# Altium schematic sheet Top Level.SchDoc
size A4
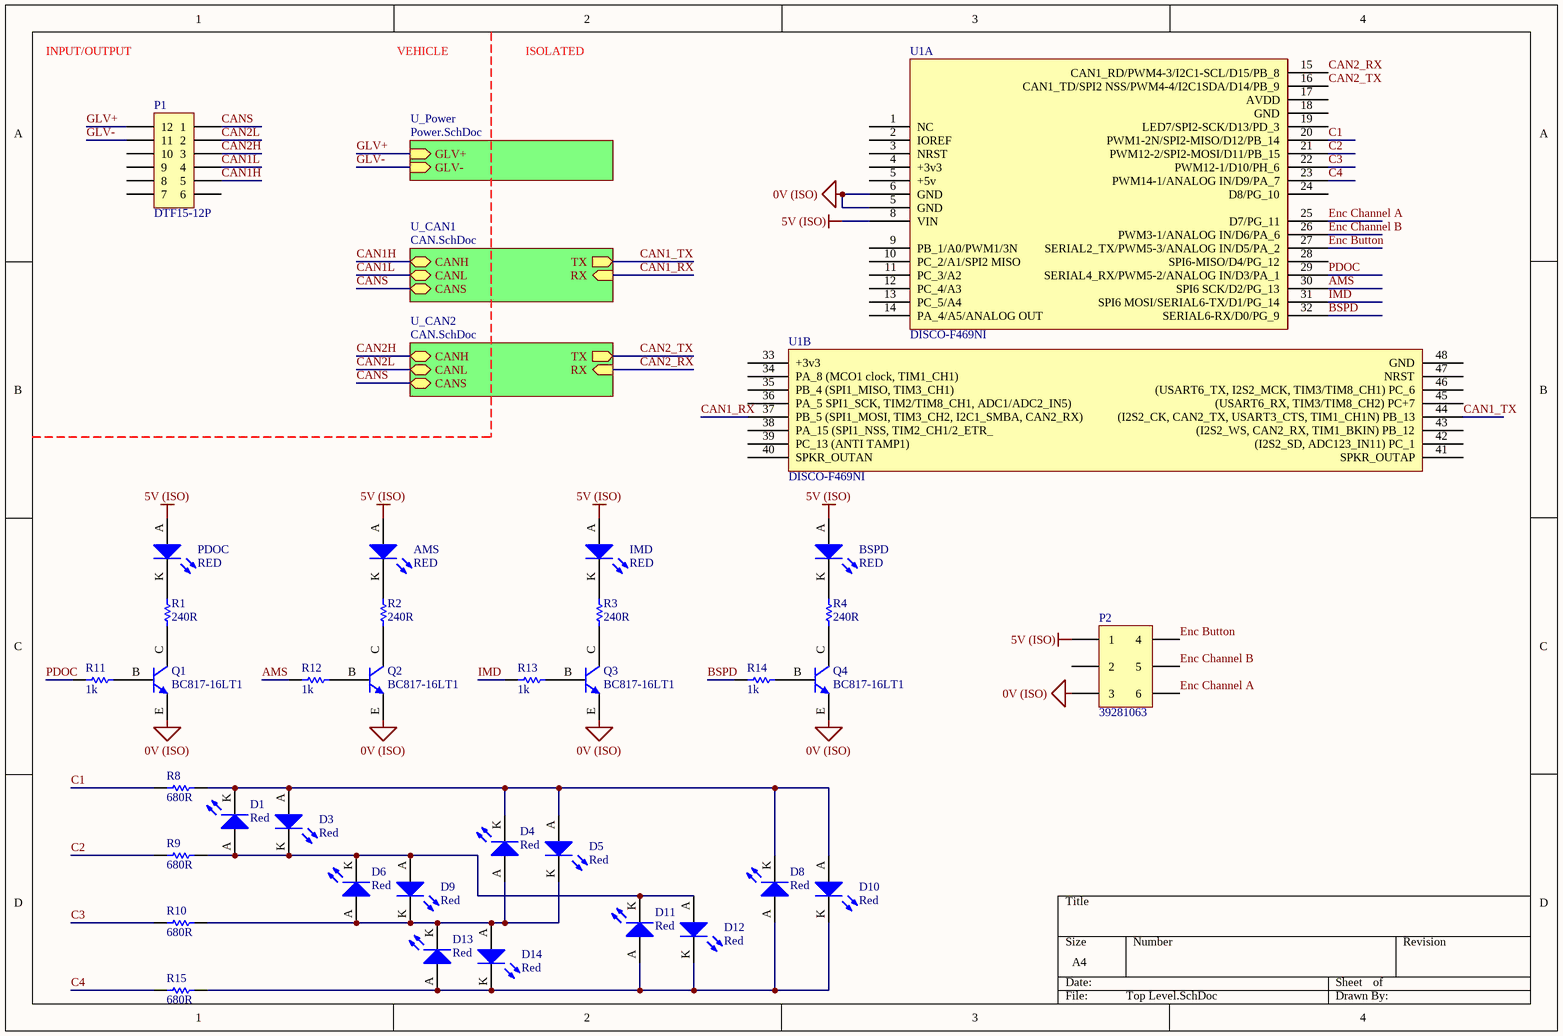
[diagram p0: Top Level.SchDoc]

## Parts
AMS  RED  [5MM LED]
BSPD  RED  [5MM LED]
D1  Red  [0805 LED]
D3  Red  [0805 LED]
D4  Red  [0805 LED]
D5  Red  [0805 LED]
D6  Red  [0805 LED]
D8  Red  [0805 LED]
D9  Red  [0805 LED]
D10  Red  [0805 LED]
D11  Red  [0805 LED]
D12  Red  [0805 LED]
D13  Red  [0805 LED]
D14  Red  [0805 LED]
IMD  RED  [5MM LED]
P1  DTF15-12P  [DTF15-12P]
P2  39281063  [39281063]
PDOC  RED  [5MM LED]
Q1  BC817-16LT1  [ON SOT-23 BJT]
Q2  BC817-16LT1  [ON SOT-23 BJT]
Q3  BC817-16LT1  [ON SOT-23 BJT]
Q4  BC817-16LT1  [ON SOT-23 BJT]
R1  240R  [0805]
R2  240R  [0805]
R3  240R  [0805]
R4  240R  [0805]
R8  680R  [0805]
R9  680R  [0805]
R10  680R  [0805]
R11  1k  [0805]
R12  1k  [0805]
R13  1k  [0805]
R14  1k  [0805]
R15  680R  [0805]
U1  DISCO-F469NI  [DISCO-F469NI]  (parts A,B of 2)

## Sub-sheets
U_CAN1 = CAN.SchDoc: CANH (bidir), CANL (bidir), CANS (bidir), RX (in), TX (out)
U_CAN2 = CAN.SchDoc: CANH (bidir), CANL (bidir), CANS (bidir), RX (in), TX (out)
U_Power = Power.SchDoc: GLV+ (in), GLV- (in)

## Nets
0V (ISO): P2.3 Q1.E Q2.E Q3.E Q4.E U1.5(GND) U1.6(GND)
5V (ISO): AMS.A BSPD.A IMD.A P2.1 PDOC.A U1.8(VIN)
AMS: R12.1 U1.30(SPI6_SCK/D2/PG_13)
BSPD: R14.1 U1.32(SERIAL6-RX/D0/PG_9)
C1: R8.2 U1.20(PWM1-2N/SPI2-MISO/D12/PB_14)
C2: R9.2 U1.21(PWM12-2/SPI2-MOSI/D11/PB_15)
C3: R10.2 U1.22(PWM12-1/D10/PH_6)
C4: R15.2 U1.23(PWM14-1/ANALOG_IN/D9/PA_7)
CAN1_RX: U1.37(PB_5_(SPI1_MOSI,_TIM3_CH2,_I2C1_SMBA,_CAN2_RX)) ; sheet U_CAN1/RX
CAN1_TX: U1.44((I2S2_CK,_CAN2_TX,_USART3_CTS,_TIM1_CH1N)_PB_13) ; sheet U_CAN1/TX
CAN1H: P1.5 ; sheet U_CAN1/CANH
CAN1L: P1.4 ; sheet U_CAN1/CANL
CAN2_RX: U1.15(CAN1_RD/PWM4-3/I2C1-SCL/D15/PB_8) ; sheet U_CAN2/RX
CAN2_TX: U1.16(CAN1_TD/SPI2_NSS/PWM4-4/I2C1SDA/D14/PB_9) ; sheet U_CAN2/TX
CAN2H: P1.3 ; sheet U_CAN2/CANH
CAN2L: P1.2 ; sheet U_CAN2/CANL
CANS: P1.1 ; sheet U_CAN2/CANS, sheet U_CAN1/CANS
Enc Button: P2.4 U1.27(SERIAL2_TX/PWM5-3/ANALOG_IN/D5/PA_2)
Enc Channel A: P2.6 U1.25(D7/PG_11)
Enc Channel B: P2.5 U1.26(PWM3-1/ANALOG_IN/D6/PA_6)
GLV+: P1.12 ; sheet U_Power/GLV+
GLV-: P1.11 ; sheet U_Power/GLV-
IMD: R13.1 U1.31(SPI6_MOSI/SERIAL6-TX/D1/PG_14)
PDOC: R11.1 U1.29(SERIAL4_RX/PWM5-2/ANALOG_IN/D3/PA_1)
NetAMS_K: AMS.K R2.2
NetBSPD_K: BSPD.K R4.2
NetD1_A: D1.A D3.K D6.K D9.A D11.K D12.A R9.1
NetD1_K: D1.K D3.A D4.K D5.A D8.K D10.A R8.1
NetD4_A: D4.A D5.K D6.A D9.K D13.K D14.A R10.1
NetD8_A: D8.A D10.K D11.A D12.K D13.A D14.K R15.1
NetIMD_K: IMD.K R3.2
NetPDOC_K: PDOC.K R1.2
NetQ1_B: Q1.B R11.2
NetQ1_C: Q1.C R1.1
NetQ2_B: Q2.B R12.2
NetQ2_C: Q2.C R2.1
NetQ3_B: Q3.B R13.2
NetQ3_C: Q3.C R3.1
NetQ4_B: Q4.B R14.2
NetQ4_C: Q4.C R4.1

Not connected (* = marked no-connect by the designer): P1 6 7 8 9 10; P2 2; U1 1(NC) 2(IOREF) 3(NRST) 4(+3v3) 9(PB_1/A0/PWM1/3N) 10(PC_2/A1/SPI2_MISO) 11(PC_3/A2) 12(PC_4/A3) 13(PC_5/A4) 14(PA_4/A5/ANALOG_OUT) 17(AVDD) 18(GND) 19(LED7/SPI2-SCK/D13/PD_3) 24(D8/PG_10) 28(SPI6-MISO/D4/PG_12) 33(+3v3) 34(PA_8_(MCO1_clock,_TIM1_CH1)) 35(PB_4_(SPI1_MISO,_TIM3_CH1)) 36(PA_5_SPI1_SCK,_TIM2/TIM8_CH1,_ADC1/ADC2_IN5)) 38(PA_15_(SPI1_NSS,_TIM2_CH1/2_ETR_) 39(PC_13_(ANTI_TAMP1)) 40(SPKR_OUTAN) 41(SPKR_OUTAP) 42((I2S2_SD,_ADC123_IN11)_PC_1) 43((I2S2_WS,_CAN2_RX,_TIM1_BKIN)_PB_12) 45((USART6_RX,_TIM3/TIM8_CH2)_PC+7) 46((USART6_TX,_I2S2_MCK,_TIM3/TIM8_CH1)_PC_6) 47(NRST) 48(GND)

## Notes on the sheet
- INPUT/OUTPUT
- VEHICLE
- ISOLATED

## Library data of the parts
AMS BSPD IMD PDOC = C503B-GAN-CB0F0791: LED RED CLEAR 5MM ROUND T/H; Manufacturer: Cree Inc.; Part Number: C503B-GAN-CB0F0791; Colour: Green; Digikey Part Number: C503B-GAN-CB0F0791-ND; Digikey Link: https://www.digikey.com/products/en?mpart=C503B-GAN-CB0F0791&v=90&fbclid=IwAR2JUDlssEKQKztQKB3h34IlXIXn-Voov26K1DpWHwQ6mgzekaFZMifRLJU
D1 D3-D6 D8-D14 = SML-210LTT86: Red LED Indication - Discrete 1.75V 0805 (2012 Metric); Manufacturer: ROHM Semiconductor; Part Number: SML-210LTT86; Colour: Red; Digikey Part Number: 511-1286-1-ND; Digikey Link: https://www.digikey.com/product-detail/en/rohm-semiconductor/SML-210LTT86/511-1286-1-ND/637099
P1 = DT15-12P: Positions: 12; Pitch: 4.44mm; Row Spacing: 9.12 mm; Angle: 0; Flange: No; Contact: Copper Alloy; Part Number: DTF15-12P; Digikey Part Number: 1734-1647-ND; Digikey Link: https://www.digikey.com.au/product-detail/en/te-connectivity-deutsch-connectors/DTF15-12PA/1734-1647-ND/7220164
P2 = 39281063: Mini-Fit VERT 3x2; Positions: 6; Pitch: 4.20mm; Row Spacing: 4.2mm; Angle: 0; Flange: No; Contact: Gold; Part Number: 39281063; Digikey Part Number: WM3802-ND; Digikey Link: https://www.digikey.com/product-detail/en/molex/0039281063/WM3802-ND/61404
Q1-Q4 = BC817-16LT1: 300mW  BJT NPN Transistor; Manufacturer: ON Semiconductor; Part Number: BC817-16LT1; Digikey Part Number: BC817-16LT1OSTR-ND; Digikey Link: https://www.digikey.com.au/product-detail/en/on-semiconductor/BC817-16LT1/BC817-16LT1OSTR-ND/606178
R1-R4 = RC0805FR07240RL: Manufacturer: YAGEO; Tolerance: 0.01; Rated Voltage: 0.125W; Part Number: RC0805FR07240RL; Value: 240R; Material: FR-07; qty: 50
R8-R10 R15 = RC0805FR07680RL: Manufacturer: YAGEO; Tolerance: 0.01; Rated Voltage: 0.125W; Part Number: RC0805FR07680RL; Value: 680R; Material: FR-07; qty: 50
R11-R14 = RC0805FR071KL: Manufacturer: YAGEO; Tolerance: 0.01; Rated Voltage: 0.125W; Part Number: RC0805FR071KL; Value: 1k; Material: FR-07; qty: 50
U1 = DISCO-F469NI: STM32F469 Discovery STM32F4 ARM® Cortex®-M4 MCU 32-Bit Embedded Evaluation Board  (The Disco 69 lol); Manufacturer: STMicroelectronics; Part Number: DISCO-F469NI; Digikey Part Number: 497-15990-ND; Digikey Link: https://www.digikey.com/product-detail/en/stmicroelectronics/STM32F469I-DISCO/497-15990-ND/5428811